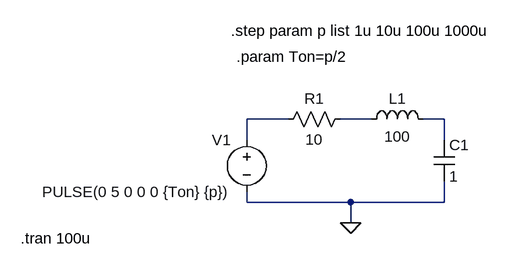
[diagram p0: schematic RLC with .step and .param func..asc]
RLC with .step and .param func..asc, the LTspice schematic file:
Version 4
SHEET 1 880 680
WIRE 80 112 16 112
WIRE 208 112 160 112
WIRE 320 112 288 112
WIRE 16 144 16 112
WIRE 320 144 320 112
WIRE 16 240 16 224
WIRE 176 240 16 240
WIRE 320 240 320 208
WIRE 320 240 176 240
WIRE 176 272 176 240
FLAG 176 272 0
SYMBOL res 176 96 R90
WINDOW 0 0 56 VBottom 2
WINDOW 3 32 56 VTop 2
SYMATTR InstName R1
SYMATTR Value 10
SYMBOL cap 304 208 M180
WINDOW 0 24 56 Left 2
WINDOW 3 24 8 Left 2
SYMATTR InstName C1
SYMATTR Value 1
SYMBOL ind 192 128 R270
WINDOW 0 32 56 VTop 2
WINDOW 3 5 56 VBottom 2
SYMATTR InstName L1
SYMATTR Value 100
SYMBOL voltage 16 128 M0
WINDOW 123 0 0 Left 0
WINDOW 39 0 0 Left 0
SYMATTR InstName V1
SYMATTR Value PULSE(0 5 0 0 0 {Ton} {p})
TEXT -8 -24 Left 2 !.step param p list 1u 10u 100u 1000u
TEXT 0 16 Left 2 !.param Ton=p/2
TEXT -332 296 Left 2 !.tran 100u

The netlist it stands for:
* RLC with .step and .param func..asc
R1 N002 N001 10
C1 0 N003 1
L1 N002 N003 100
V1 N001 0 PULSE(0 5 0 0 0 {Ton} {p})
.step param p list 1u 10u 100u 1000u
.param Ton=p/2
.tran 100u
.backanno
.end